# EAGLE schematic brush (EAGLE 6.3)
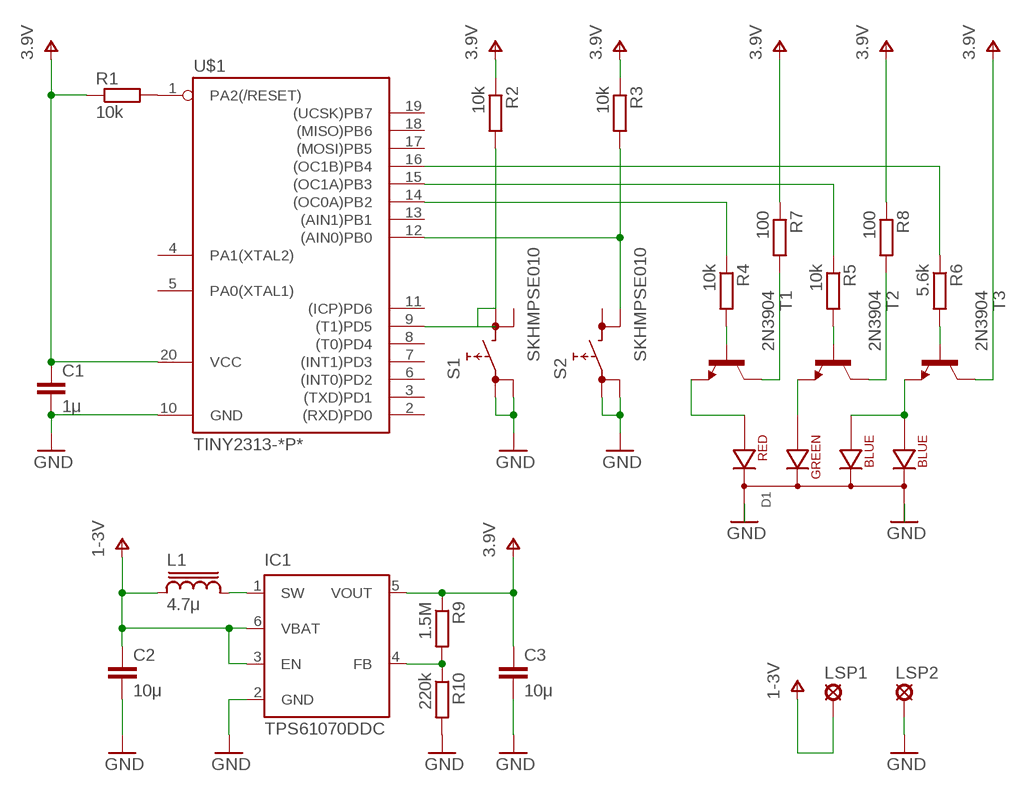
[diagram p0: schematic, sheet 1]

## Parts
C1  1μ  C-EUC1206  [C1206]
C2  10μ  C-EUC1206  [C1206]
C3  10μ  C-EUC1206  [C1206]
D1  LED-RGB-CC-THRUDIFFUSE  [LED-RGB-THRU]
IC1  TPS61070DDC  [TSOT23-6_DDC]
L1  4.7μ  CR43  [CR43]
LSP1  LSP10  [LSP10]
LSP2  LSP10  [LSP10]
R1  10k  R-EU_R1206  [R1206]
R2  10k  R-EU_R1206  [R1206]
R3  10k  R-EU_R1206  [R1206]
R4  10k  R-EU_R1206  [R1206]
R5  10k  R-EU_R1206  [R1206]
R6  5.6k  R-EU_R1206  [R1206]
R7  100  R-EU_R1206  [R1206]
R8  100  R-EU_R1206  [R1206]
R9  1.5M  R-EU_R1206  [R1206]
R10  220k  R-EU_R1206  [R1206]
S1  SKHMPSE010  [SKHMPXE010]
S2  SKHMPSE010  [SKHMPXE010]
T1  2N3904  [TO92]
T2  2N3904  [TO92]
T3  2N3904  [TO92]
U$1  TINY2313-*P*  [DIL20]

## Nets
GND: C1.2 C2.2 C3.2 D1.CATHODE1 D1.CATHODE2 IC1.2(GND) LSP2.MP R10.2 S1.1(1.1) S1.2(1.2) S2.1(1.1) S2.2(1.2) U$1.10(GND)
N$1: R1.2 U$1.1(PA2(/RESET))
N$2: D1.RED T1.3(E)
N$3: D1.GREEN T2.3(E)
N$4: D1.BLUE1 D1.BLUE2 T3.3(E)
N$5: R4.2 T1.2(B)
N$6: R5.2 T2.2(B)
N$7: R6.2 T3.2(B)
N$8: R4.1 U$1.14((OC0A)PB2)
N$9: R5.1 U$1.15((OC1A)PB3)
N$10: R6.1 U$1.16((OC1B)PB4)
N$11: R7.2 T1.1(C)
N$12: R8.2 T2.1(C)
N$13: IC1.1(SW) L1.2
N$14: IC1.4(FB) R9.2 R10.1
N$15: R2.2 S1.3(2.1) U$1.9((T1)PD5)
N$16: R3.2 S2.4(2.2) U$1.12((AIN0)PB0)
V+: C1.1 C2.1 C3.1 IC1.3(EN) IC1.5(VOUT) IC1.6(VBAT) L1.1 LSP1.MP R1.1 R2.1 R3.1 R7.1 R8.1 R9.1 T3.1(C) U$1.20(VCC) ; supply symbol labelled 3.9V, 1-3V
Unconnected: S1.4(2.2) S2.3(2.1) U$1.2((RXD)PD0) U$1.3((TXD)PD1) U$1.4(PA1(XTAL2)) U$1.5(PA0(XTAL1)) U$1.6((INT0)PD2) U$1.7((INT1)PD3) U$1.8((T0)PD4) U$1.11((ICP)PD6) U$1.13((AIN1)PB1) U$1.17((MOSI)PB5) U$1.18((MISO)PB6) U$1.19((UCSK)PB7)

## Library data of the parts
C1-C3 = rcl:C-EU: CAPACITOR, European symbol
D1 = Gumix:LED-RGB-CC-THRU: RGB Through-hole common cathode LED SparkFun Storefront: COM-00105 (Clear) COM-09264 (Diffuse); PROD_ID: DIO-09434
IC1 = Gumix:TPS6107*: 90% EFFICIENT SYNCHRONOUS BOOST CONVERTER WITH 600-mA SWITCH Source: http://focus.ti.com/lit/ds/symlink/tps61070.pdf; MPN: TPS61070DDCR; OC_FARNELL: 1461062; OC_NEWARK: 64M3125
L1 = inductor-sumida:CR43: Power Inductor
LSP1 LSP2 = solpad:LSP10: SOLDER PAD drill 1.0 mm, distributor Buerklin, 12H555
R1-R10 = resistor:R-EU_: RESISTOR, European symbol
S1 S2 = Gumix:SKHMP*E010: 6.2 X 6.5mm TACT Switch (SMD) Source: http://www3.alps.co.jp/WebObjects/catalog.woa/PDF/E/Switch/Tact/SKHM/SKHM.PDF
T1-T3 = transistor:2N3904: NPN TRANSISTOR
U$1 = avr-6:TINY2313*: Atmel Tiny2313 2K Flash, 128 bytes EEPROM, 128 bytes RAM